# EAGLE design MIA_Array (EAGLE 8.0.0)
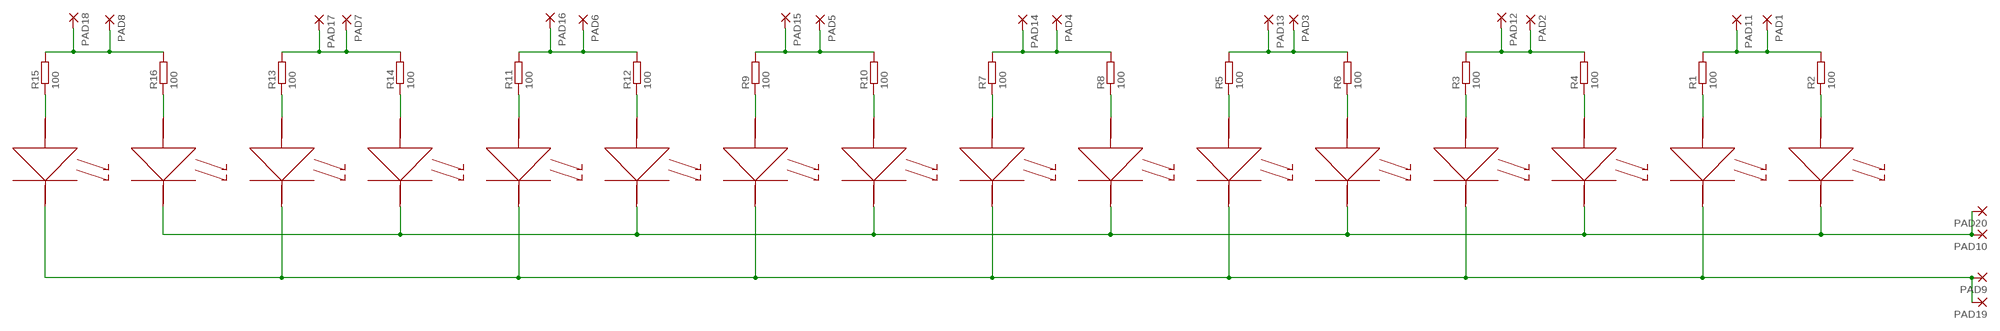
[diagram p0: schematic, sheet 1]

## Parts
PAD1  2,54/1,1  [2,54/1,1]
PAD2  2,54/1,1  [2,54/1,1]
PAD3  2,54/1,1  [2,54/1,1]
PAD4  2,54/1,1  [2,54/1,1]
PAD5  2,54/1,1  [2,54/1,1]
PAD6  2,54/1,1  [2,54/1,1]
PAD7  2,54/1,1  [2,54/1,1]
PAD8  2,54/1,1  [2,54/1,1]
PAD9  2,54/1,1  [2,54/1,1]
PAD10  2,54/1,1  [2,54/1,1]
PAD11  2,54/1,1  [2,54/1,1]
PAD12  2,54/1,1  [2,54/1,1]
PAD13  2,54/1,1  [2,54/1,1]
PAD14  2,54/1,1  [2,54/1,1]
PAD15  2,54/1,1  [2,54/1,1]
PAD16  2,54/1,1  [2,54/1,1]
PAD17  2,54/1,1  [2,54/1,1]
PAD18  2,54/1,1  [2,54/1,1]
PAD19  2,54/1,1  [2,54/1,1]
PAD20  2,54/1,1  [2,54/1,1]
R1  100  R-EU_0411/15  [0411/15]
R2  100  R-EU_0411/15  [0411/15]
R3  100  R-EU_0411/15  [0411/15]
R4  100  R-EU_0411/15  [0411/15]
R5  100  R-EU_0411/15  [0411/15]
R6  100  R-EU_0411/15  [0411/15]
R7  100  R-EU_0411/15  [0411/15]
R8  100  R-EU_0411/15  [0411/15]
R9  100  R-EU_0411/15  [0411/15]
R10  100  R-EU_0411/15  [0411/15]
R11  100  R-EU_0411/15  [0411/15]
R12  100  R-EU_0411/15  [0411/15]
R13  100  R-EU_0411/15  [0411/15]
R14  100  R-EU_0411/15  [0411/15]
R15  100  R-EU_0411/15  [0411/15]
R16  100  R-EU_0411/15  [0411/15]
U$1  L150-3080502400000  [SMD-5050]
U$2  L150-3080502400000  [SMD-5050]
U$3  L150-3080502400000  [SMD-5050]
U$4  L150-3080502400000  [SMD-5050]
U$5  L150-3080502400000  [SMD-5050]
U$6  L150-3080502400000  [SMD-5050]
U$7  L150-3080502400000  [SMD-5050]
U$8  L150-3080502400000  [SMD-5050]
U$9  L150-3080502400000  [SMD-5050]
U$10  L150-3080502400000  [SMD-5050]
U$11  L150-3080502400000  [SMD-5050]
U$12  L150-3080502400000  [SMD-5050]
U$13  L150-3080502400000  [SMD-5050]
U$14  L150-3080502400000  [SMD-5050]
U$15  L150-3080502400000  [SMD-5050]
U$16  L150-3080502400000  [SMD-5050]

## Nets
N$1: PAD1.1(P) PAD11.1(P) R1.2 R2.2
N$2: PAD10.1(P) PAD20.1(P) U$2.CA U$2.CA2(CA) U$5.CA U$5.CA2(CA) U$7.CA U$7.CA2(CA) U$9.CA U$9.CA2(CA) U$11.CA U$11.CA2(CA) U$12.CA U$12.CA2(CA) U$14.CA U$14.CA2(CA) U$16.CA U$16.CA2(CA)
N$3: R1.1 U$4.AN U$4.AN2(AN)
N$4: R2.1 U$12.AN U$12.AN2(AN)
N$5: PAD2.1(P) PAD12.1(P) R3.2 R4.2
N$6: R3.1 U$1.AN U$1.AN2(AN)
N$7: R4.1 U$2.AN U$2.AN2(AN)
N$8: PAD3.1(P) PAD13.1(P) R5.2 R6.2
N$9: R5.1 U$3.AN U$3.AN2(AN)
N$10: R6.1 U$5.AN U$5.AN2(AN)
N$11: PAD9.1(P) PAD19.1(P) U$1.CA U$1.CA2(CA) U$3.CA U$3.CA2(CA) U$4.CA U$4.CA2(CA) U$6.CA U$6.CA2(CA) U$8.CA U$8.CA2(CA) U$10.CA U$10.CA2(CA) U$13.CA U$13.CA2(CA) U$15.CA U$15.CA2(CA)
N$12: PAD4.1(P) PAD14.1(P) R7.2 R8.2
N$13: R7.1 U$6.AN U$6.AN2(AN)
N$14: R8.1 U$7.AN U$7.AN2(AN)
N$15: PAD5.1(P) PAD15.1(P) R9.2 R10.2
N$16: R9.1 U$8.AN U$8.AN2(AN)
N$17: R10.1 U$9.AN U$9.AN2(AN)
N$18: PAD6.1(P) PAD16.1(P) R11.2 R12.2
N$19: R11.1 U$10.AN U$10.AN2(AN)
N$20: R12.1 U$11.AN U$11.AN2(AN)
N$21: PAD7.1(P) PAD17.1(P) R13.2 R14.2
N$22: R13.1 U$13.AN U$13.AN2(AN)
N$23: R14.1 U$14.AN U$14.AN2(AN)
N$24: PAD8.1(P) PAD18.1(P) R15.2 R16.2
N$25: R15.1 U$15.AN U$15.AN2(AN)
N$26: R16.1 U$16.AN U$16.AN2(AN)

## Library data of the parts
PAD1-PAD20 = wirepad:2,54/1,1: THROUGH-HOLE PAD
R1-R16 = resistor:R-EU_: RESISTOR, European symbol
U$1-U$16 = LUXEON5050:L150-3080502400000

## Board
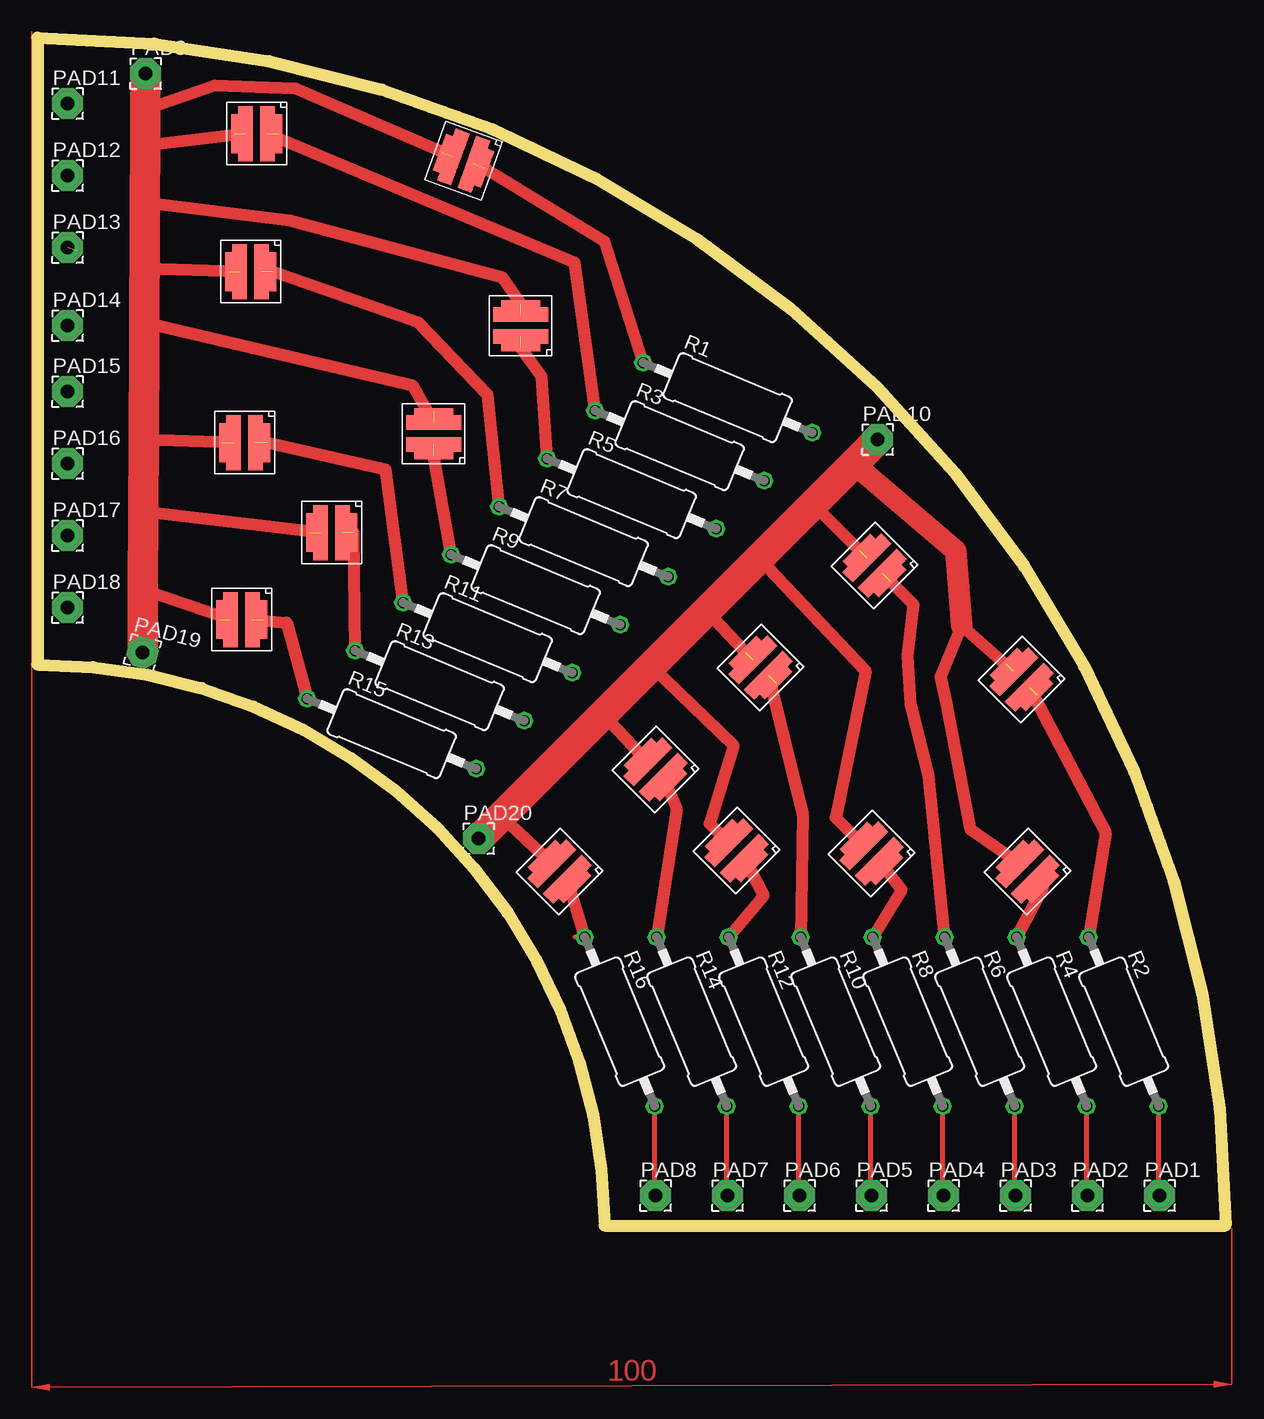
[diagram p1: board, top side]
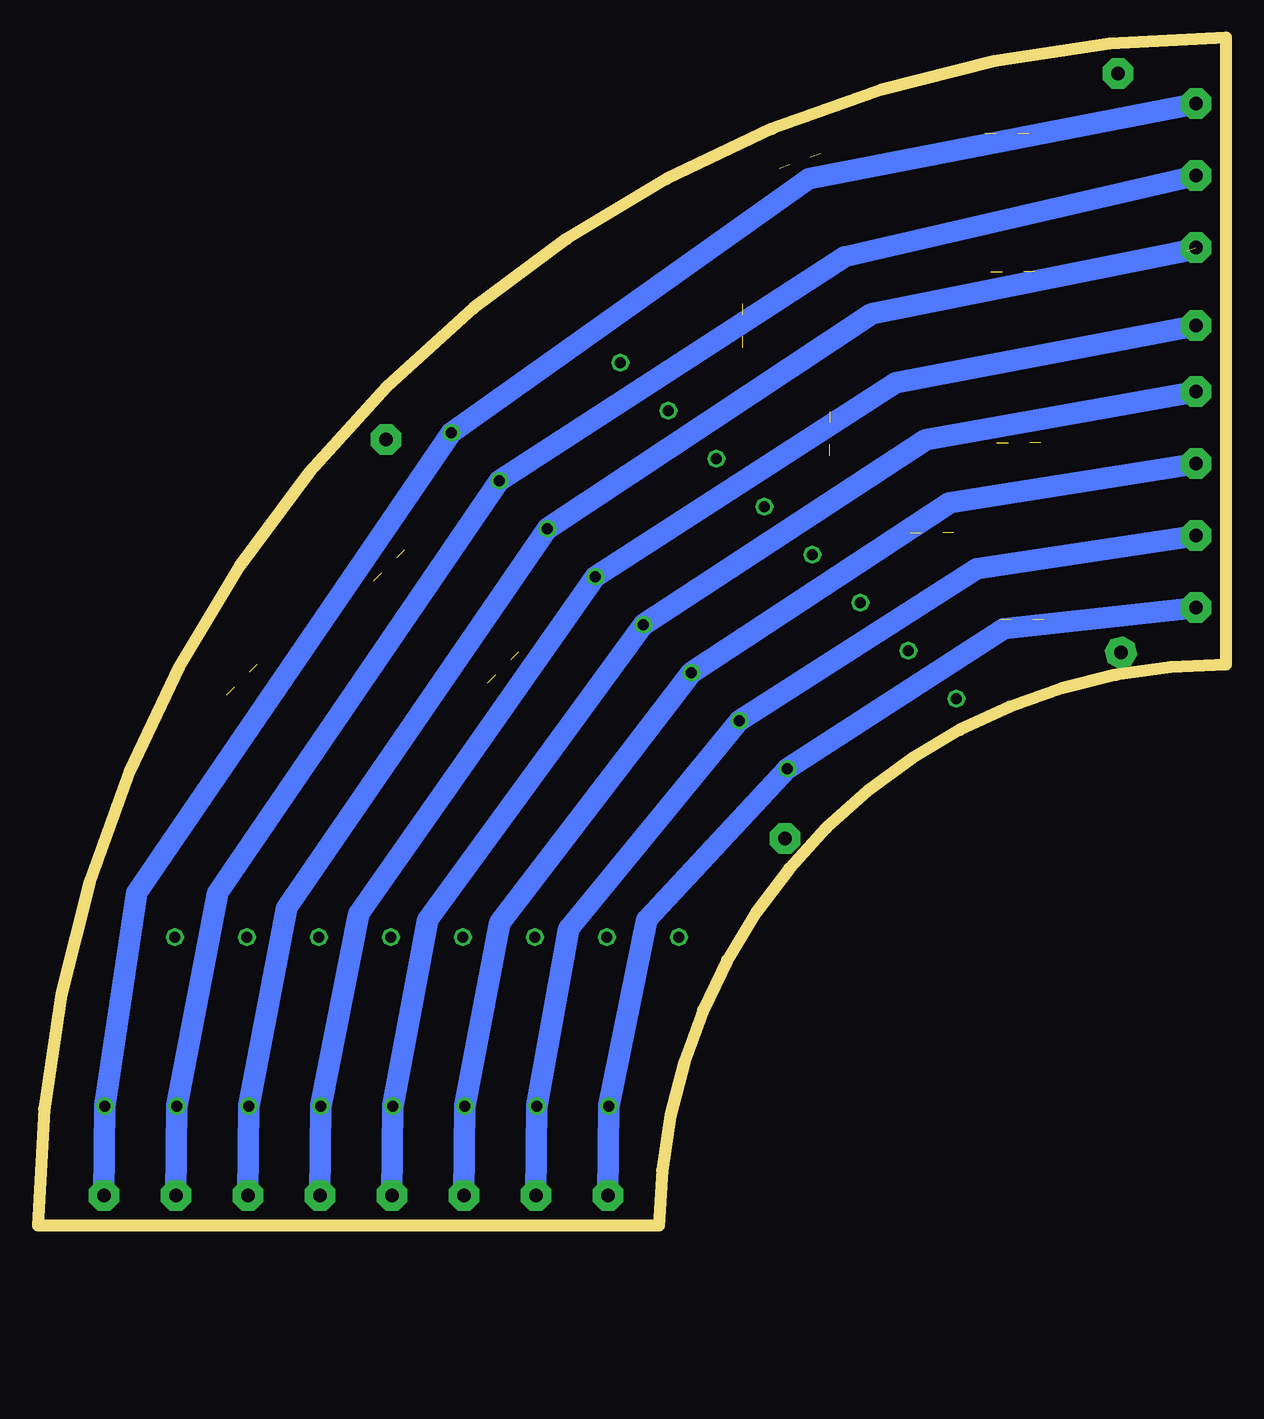
[diagram p2: board, bottom side, seen from below]

Size 99 x 99 mm. Coordinates in mm from the lower left corner, seen from the top.
Outline: 0,46.75 arc-90 47.25,0 99,0 arc90 0,99 0,46.75
Copper layers (1*16): Top 0.035mm / dielectric 1.5mm / Bottom 0.035mm
Design rules "default": minimum track width 10mil, minimum drill 24mil, track to track 8mil, track to pad 8mil, pad to pad 8mil, via to via 8mil, smd to smd 8mil, copper to edge 40mil, drill to drill 8mil, minimum pad ring 10mil, minimum via ring 8mil, stop-mask expansion 4mil, vias tented up to drill 0mil, thermal gap 10mil

### Footprints (pad centres in the part's own frame; a part is rotated, then mirrored left to right if it is on the bottom)
2,54/1,1 = drill 1.118 pad 2.54 octagon: 1 0,0
0411/15 = drill 0.914 octagon: 1 -7.62,0; 2 7.62,0
SMD-5050 = smd 1.22 x 4.58: AN -0.91,0; CA 0.91,0 | smd 0.6 x 3.24: AN2 -1.83,0; CA2 1.83,0

### Placement (x,y rotation side)
PAD1  93.5,2.5 0 top
PAD2  87.5,2.5 0 top
PAD3  81.5,2.5 0 top
PAD4  75.5,2.5 0 top
PAD5  69.5,2.5 0 top
PAD6  63.5,2.5 0 top
PAD7  57.5,2.5 0 top
PAD8  51.5,2.5 0 top
PAD9  9,96 0 top
PAD10  70,65.5 0 top
PAD11  2.5,93.5 0 top
PAD12  2.5,87.5 0 top
PAD13  2.5,81.5 0 top
PAD14  2.5,75 0 top
PAD15  2.5,69.5 0 top
PAD16  2.5,63.5 0 top
PAD17  2.5,57.5 0 top
PAD18  2.5,51.5 0 top
PAD19  8.75,47.75 345 top
PAD20  36.75,32.25 0 top
R1  57.5,69 337.5 top
R2  90.5,17 292.5 top
R3  53.5,65 337.5 top
R4  84.5,17 292.5 top
R5  49.5,61 337.5 top
R6  78.5,17 292.5 top
R7  45.5,57 337.5 top
R8  72.5,17 292.5 top
R9  41.5,53 337.5 top
R10  66.5,17 292.5 top
R11  37.5,49 337.5 top
R12  60.5,17 292.5 top
R13  33.5,45 337.5 top
R14  54.5,17 292.5 top
R15  29.5,41 337.5 top
R16  48.5,17 292.5 top
U$1  18.25,91 180 top
U$2  82.5,29.5 135 top
U$3  40.25,75 90 top
U$4  35.5,88.75 160 top
U$5  69.75,55 135 top
U$6  17.75,79.5 180 top
U$7  69.5,31 135 top
U$8  33,66 90 top
U$9  60.25,46.5 135 top
U$10  17.25,65.25 180 top
U$11  58.25,31.25 135 top
U$12  82,45.5 135 top
U$13  24.5,57.75 180 top
U$14  51.5,38 135 top
U$15  17,50.5 180 top
U$16  43.5,29.5 135 top

### Tracks (layer width: path | path; a pad name or v marks a point on that pad's centre or on a via)
N$1
  Top 0.406: PAD1.1 93.42,2.5 R2.2
  Bottom 1.778: PAD1.1 R2.2 90.75,27.75 R1.2 34.75,87.25 PAD11.1
N$2  (3 unrouted)
  Top 0.406: U$2.CA2 U$2.CA | U$7.CA2 U$7.CA | U$11.CA2 U$11.CA | U$14.CA2 U$14.CA | U$16.CA2 U$16.CA
  Top 1.016: U$9.CA 55.75,51.25 | U$5.CA 65,59.75 64.38,59.88 | U$14.CA 47.12,42.62 | U$16.CA 38.62,34.12 | U$11.CA 56,33.5 58,40 51.12,46.62 | U$7.CA 66.5,34 69,46.25 60.12,55.62 | U$12.CA 77,50 75.25,45.75 75.75,43.5 77.75,33 U$2.CA
  Top 1.778: 77,50 76.5,56.25 68,63.5
  Top 2.54: PAD20.1 38.62,34.12 47.12,42.62 51.12,46.62 55.75,51.25 60.12,55.62 64.38,59.88 68,63.5 PAD10.1
N$3  (1 unrouted)
  Top 1.016: R1.1 47.25,82 U$4.AN2
N$4  (1 unrouted)
  Top 1.016: U$12.AN 89,32.75 R2.1
N$5
  Top 0.406: PAD2.1 87.42,2.5 R4.2
  Bottom 1.778: PAD2.1 R4.2 84,27.75 R3.2 31.75,80.75 PAD12.1
N$6  (1 unrouted)
  Top 1.016: R3.1 44.75,80.25 U$1.AN
N$7
  Top 0.406: U$2.AN2 U$2.AN
  Top 1.016: R4.1 U$2.AN2
N$8  (1 unrouted)
  Top 0.406: PAD3.1 81.42,2.5 R6.2
  Bottom 1.778: PAD3.1 R6.2 78.25,26.5 R5.2 29.5,76 3.25,81.25
N$9  (1 unrouted)
  Top 1.016: R5.1 42,70.75 U$3.AN2
N$10  (1 unrouted)
  Top 1.016: R6.1 74.25,37.5 72.75,43.5 72.5,47.5 73,51.75 U$5.AN
N$11  (8 unrouted)
  Top 1.016: U$15.CA 8.77,53 | U$10.CA 8.84,65.5 | U$13.CA 8.81,59.5 | U$6.CA 8.91,79.75 | U$1.CA 8.97,90 | U$8.CA 31.25,70 8.89,75.25 | U$3.CA2 38.75,79 21,83.75 8.94,85.25 | U$4.CA 21.5,94.75 14.75,95 8.98,93
  Top 2.54: PAD9.1 8.98,93 8.98,91.5 8.97,90 8.94,85.25 8.91,79.75 8.91,78.25 8.89,75.25 8.88,73.5 8.84,65.5 8.81,59.5 8.77,53 PAD19.1
N$12
  Top 0.406: PAD4.1 75.42,2.5 R8.2
  Bottom 1.778: PAD4.1 R8.2 72.25,26 R7.2 27.5,70.25 PAD14.1
N$13  (1 unrouted)
  Top 1.016: R7.1 37.5,69.25 31.75,75.25 U$6.AN2
N$14
  Top 0.406: U$7.AN2 U$7.AN
  Top 1.016: U$7.AN 72,28 R8.1
N$15
  Top 0.406: PAD5.1 69.42,2.5 R10.2
  Bottom 1.778: PAD5.1 R10.2 66.5,25.5 R9.2 25,65.5 PAD15.1
N$16  (1 unrouted)
  Top 1.016: R9.1 U$8.AN2
N$17  (1 unrouted)
  Top 0.406: R10.1 63.5,24.12
  Top 1.016: U$9.AN 63.75,34.25 R10.1
N$18
  Top 0.406: PAD6.1 63.42,2.5 R12.2
  Bottom 1.778: PAD6.1 R12.2 60.5,25.25 R11.2 23,60.25 PAD16.1
N$19  (1 unrouted)
  Top 1.016: R11.1 29,63 U$10.AN2
N$20
  Top 0.406: 58.89,30 U$11.AN U$11.AN2
  Top 1.016: U$11.AN 60.5,27.5 R12.1
N$21
  Top 0.406: PAD7.1 57.42,2.5 R14.2
  Bottom 1.778: PAD7.1 R14.2 54.75,24.75 R13.2 20.75,54.75 PAD17.1
N$22  (1 unrouted)
  Top 1.016: R13.1 U$13.AN2
N$23
  Top 0.406: R14.1 51.5,24.21 | U$14.AN2 U$14.AN
  Top 1.016: U$14.AN 53.25,34.75 R14.1
N$24  (via drill 0.6)
  Top 0.406: v51.42,2.5 R16.2
  Bottom 0.406: v51.42,2.5 PAD8.1
  Bottom 1.778: PAD8.1 R16.2 48.25,25.5 R15.2 18.5,49.75 PAD18.1
N$25  (1 unrouted)
  Top 1.016: U$15.AN 20.75,50.25 R15.1
N$26
  Top 0.406: R16.1 44.79,24.04 | U$16.AN2 44.14,28.21 U$16.AN
  Top 1.016: U$16.AN R16.1
(copper drawn outside any net)
  shapes: Top area x2